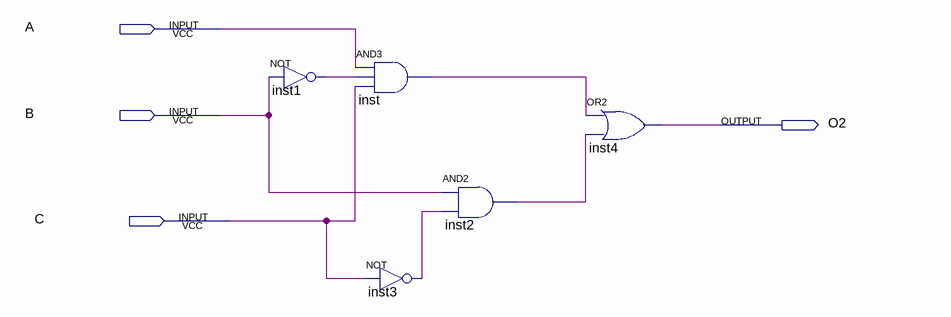
[diagram p0: schematic sheet]
// Quartus schematic F2.bdf as structural Verilog: 5 symbols, 4 pins
module F2 (
  input  A,
  input  B,
  input  C,
  output O2
);

  wire inst1_out, inst2_out, inst3_out, inst_out;

  not inst1 (inst1_out, B);
  and inst (inst_out, A, inst1_out, C);
  not inst3 (inst3_out, C);
  and inst2 (inst2_out, B, inst3_out);
  or inst4 (O2, inst_out, inst2_out);
endmodule
